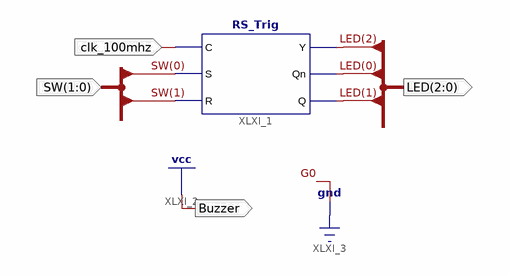
[diagram p0: schematic sheet 1]
// Xilinx ISE schematic Top_RS_Trig.sch (kintex7) as structural Verilog: 1 symbols, 4 ports
module Top_RS_Trig (
  input  [1:0] SW,
  input  clk_100mhz,
  output [2:0] LED,
  output Buzzer
);

  RS_Trig XLXI_1 (.C(clk_100mhz), .S(SW[0]), .R(SW[1]), .Y(LED[2]), .Qn(LED[0]), .Q(LED[1]));

  assign Buzzer = 1'b1;
endmodule
